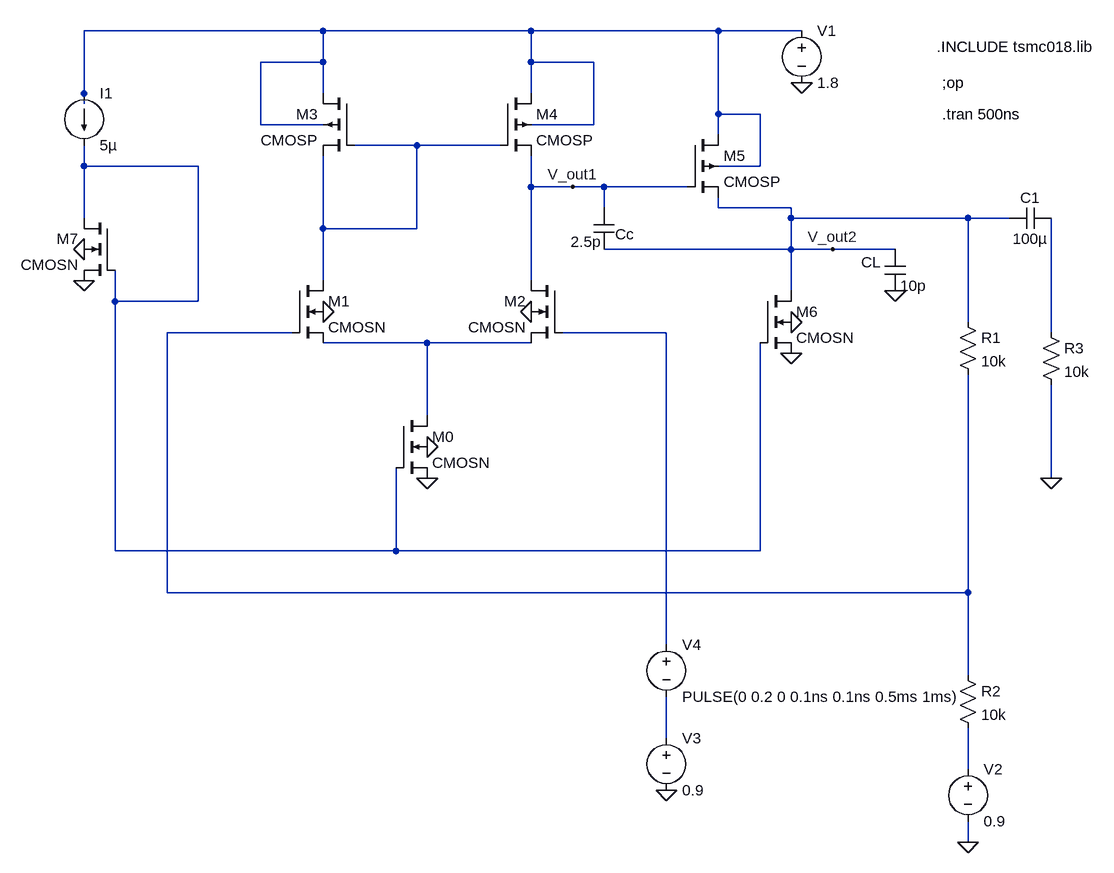
[diagram p0: schematic 2stageOTA.asc]
2stageOTA.asc, the LTspice schematic file:
Version 4
SHEET 1 1908 1496
WIRE 96 -160 -272 -160
WIRE 416 -160 96 -160
WIRE 704 -160 416 -160
WIRE 832 -160 704 -160
WIRE 96 -112 96 -160
WIRE 96 -112 0 -112
WIRE 416 -112 416 -160
WIRE 512 -112 416 -112
WIRE -272 -64 -272 -160
WIRE 96 -64 96 -112
WIRE 416 -64 416 -112
WIRE -272 -48 -272 -64
WIRE 704 -32 704 -160
WIRE 768 -32 704 -32
WIRE 0 -16 0 -112
WIRE 96 -16 0 -16
WIRE 512 -16 512 -112
WIRE 512 -16 416 -16
WIRE 704 0 704 -32
WIRE 240 16 144 16
WIRE 368 16 240 16
WIRE -272 48 -272 16
WIRE -96 48 -272 48
WIRE 768 48 768 -32
WIRE 768 48 704 48
WIRE 416 80 416 32
WIRE 480 80 416 80
WIRE 528 80 480 80
WIRE 656 80 528 80
WIRE 528 112 528 80
WIRE 704 112 704 96
WIRE 816 112 704 112
WIRE -272 128 -272 48
WIRE 816 128 816 112
WIRE 1088 128 816 128
WIRE 1152 128 1088 128
WIRE 96 144 96 32
WIRE 240 144 240 16
WIRE 240 144 96 144
WIRE 816 176 816 128
WIRE 816 176 528 176
WIRE 880 176 816 176
WIRE 976 176 880 176
WIRE 96 224 96 144
WIRE 416 224 416 80
WIRE 816 240 816 176
WIRE -224 256 -224 208
WIRE -96 256 -96 48
WIRE -96 256 -224 256
WIRE 1088 288 1088 128
WIRE 48 304 -144 304
WIRE 624 304 464 304
WIRE 1216 304 1216 128
WIRE 256 320 96 320
WIRE 416 320 256 320
WIRE 256 432 256 320
WIRE 1216 528 1216 384
WIRE -224 640 -224 256
WIRE 208 640 208 512
WIRE 208 640 -224 640
WIRE 768 640 768 320
WIRE 768 640 208 640
WIRE -144 704 -144 304
WIRE 1088 704 1088 368
WIRE 1088 704 -144 704
WIRE 624 784 624 304
WIRE 1088 832 1088 704
WIRE 624 928 624 864
WIRE 1088 976 1088 912
WIRE 1088 1088 1088 1056
FLAG 832 -80 0
FLAG 96 272 0
FLAG 416 272 0
FLAG 256 480 0
FLAG 256 528 0
FLAG -272 176 0
FLAG -272 224 0
FLAG 480 80 V_out1
FLAG 816 288 0
FLAG 816 336 0
FLAG 976 240 0
FLAG 880 176 V_out2
FLAG 1216 528 0
FLAG 1088 1088 0
FLAG 624 1008 0
SYMBOL voltage 832 -176 R0
WINDOW 123 0 0 Left 2
WINDOW 39 0 0 Left 2
SYMATTR InstName V1
SYMATTR Value 1.8
SYMBOL cmosp 368 -64 R0
SYMATTR InstName M4
SYMATTR Value2 l=1u w=15.4321u
SYMBOL cmosp 144 -64 M0
SYMATTR InstName M3
SYMATTR Value2 l=1u w=15.4321u
SYMBOL cmosn 48 224 R0
SYMATTR InstName M1
SYMATTR Value2 l=1u w=2.14557u
SYMBOL cmosn 464 224 M0
SYMATTR InstName M2
SYMATTR Value2 l=1u w=2.14557u
SYMBOL cmosn 208 432 R0
SYMATTR InstName M0
SYMATTR Value2 l=1u w=34.85u
SYMBOL voltage 1088 960 R0
WINDOW 123 0 0 Left 2
WINDOW 39 0 0 Left 2
SYMATTR InstName V2
SYMATTR Value 0.9
SYMBOL current -272 -64 R0
WINDOW 123 0 0 Left 2
WINDOW 39 0 0 Left 2
SYMATTR InstName I1
SYMATTR Value 5µ
SYMBOL cmosn -224 128 M0
SYMATTR InstName M7
SYMATTR Value2 l=1u w=3.485u
SYMBOL cmosp 656 0 R0
SYMATTR InstName M5
SYMATTR Value2 l=1u w=87.27u
SYMBOL cap 512 112 R0
WINDOW 3 -35 52 Left 2
WINDOW 0 33 41 Left 2
SYMATTR Value 2.5p
SYMATTR InstName Cc
SYMBOL cmosn 768 240 R0
SYMATTR InstName M6
SYMATTR Value2 l=1u w=98.54u
SYMBOL cap 960 176 R0
WINDOW 0 -36 20 Left 2
SYMATTR InstName CL
SYMATTR Value 10p
SYMBOL cap 1152 144 R270
WINDOW 0 32 32 VTop 2
WINDOW 3 0 32 VBottom 2
SYMATTR InstName C1
SYMATTR Value 100µ
SYMBOL res 1072 272 R0
SYMATTR InstName R1
SYMATTR Value 10k
SYMBOL res 1072 816 R0
SYMATTR InstName R2
SYMATTR Value 10k
SYMBOL res 1200 288 R0
SYMATTR InstName R3
SYMATTR Value 10k
SYMBOL voltage 624 768 R0
WINDOW 123 0 0 Left 2
WINDOW 39 0 0 Left 2
SYMATTR InstName V4
SYMATTR Value PULSE(0 0.2 0 0.1ns 0.1ns 0.5ms 1ms)
SYMBOL voltage 624 912 R0
WINDOW 123 0 0 Left 2
WINDOW 39 0 0 Left 2
SYMATTR InstName V3
SYMATTR Value 0.9
TEXT 1040 -136 Left 2 !.INCLUDE tsmc018.lib
TEXT 1048 -80 Left 2 !;op
TEXT 1048 -32 Left 2 !.tran 500ns

The netlist it stands for:
* 2stageOTA.asc
V1 N001 0 1.8
M4 N001 N002 V_out1 N001 CMOSP l=1u w=15.4321u
M3 N001 N002 N002 N001 CMOSP l=1u w=15.4321u
M1 N002 N004 N007 0 CMOSN l=1u w=2.14557u
M2 V_out1 N005 N007 0 CMOSN l=1u w=2.14557u
M0 N007 N003 0 0 CMOSN l=1u w=34.85u
V2 N009 0 0.9
I1 N001 N003 5µ
M7 N003 N003 0 0 CMOSN l=1u w=3.485u
M5 N001 V_out1 V_out2 N001 CMOSP l=1u w=87.27u
Cc V_out1 V_out2 2.5p
M6 V_out2 N003 0 0 CMOSN l=1u w=98.54u
CL V_out2 0 10p
C1 V_out2 N006 100µ
R1 V_out2 N004 10k
R2 N004 N009 10k
R3 N006 0 10k
V4 N005 N008 PULSE(0 0.2 0 0.1ns 0.1ns 0.5ms 1ms)
V3 N008 0 0.9
.model NMOS NMOS
.model PMOS PMOS
.lib standard.mos
.INCLUDE tsmc018.lib
;op
.tran 500ns
.backanno
.end